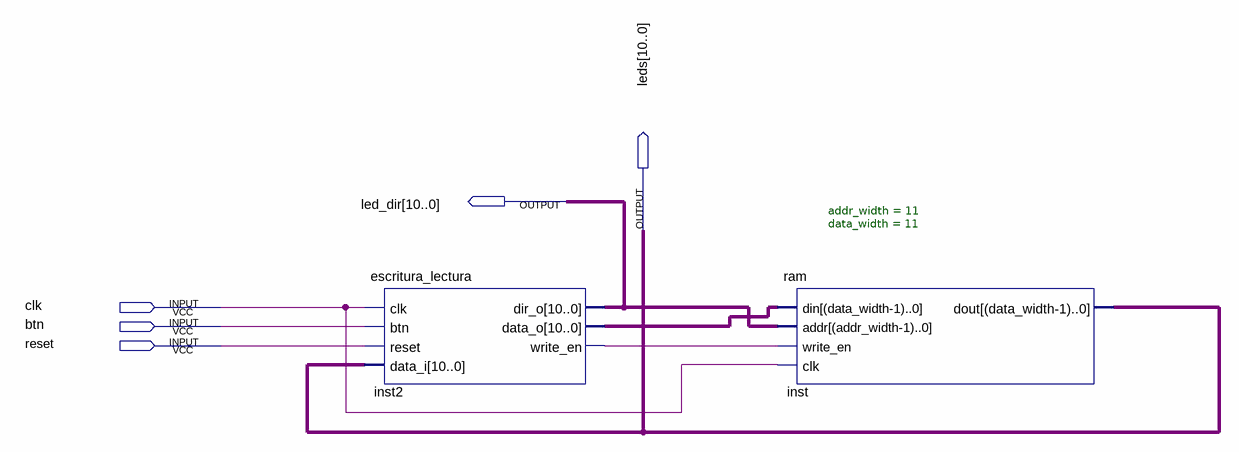
[diagram p0: schematic sheet]
// Quartus schematic Pruebas_ram.bdf as structural Verilog: 2 symbols, 5 pins
module Pruebas_ram (
  input  clk,
  input  btn,
  input  reset,
  output [10:0] led_dir,
  output [10:0] leds
);

  wire inst2_write_en;
  wire [10:0] inst2_data_o;

  escritura_lectura inst2 (
    .clk(clk), .btn(btn), .reset(reset), .data_i(leds), .dir_o(led_dir), .data_o(inst2_data_o),
    .write_en(inst2_write_en));
  ram #(.addr_width(11), .data_width(11)) inst (
    .din(inst2_data_o), .addr(led_dir), .write_en(inst2_write_en), .clk(clk), .dout(leds));
endmodule
